# Altium schematic sheet Sheet1.SchDoc
size 420 x 297 mm; Address1: Address1; Address2: Address2; Address3: Address3; Address4: Address4; DocumentNumber: АБВГ.123456.001 Э3; SheetNumber: 1; Scale: 1:1; DocumentType: Схема электрическая принципиальная; FirstReferrence: АБВГ.123456.001
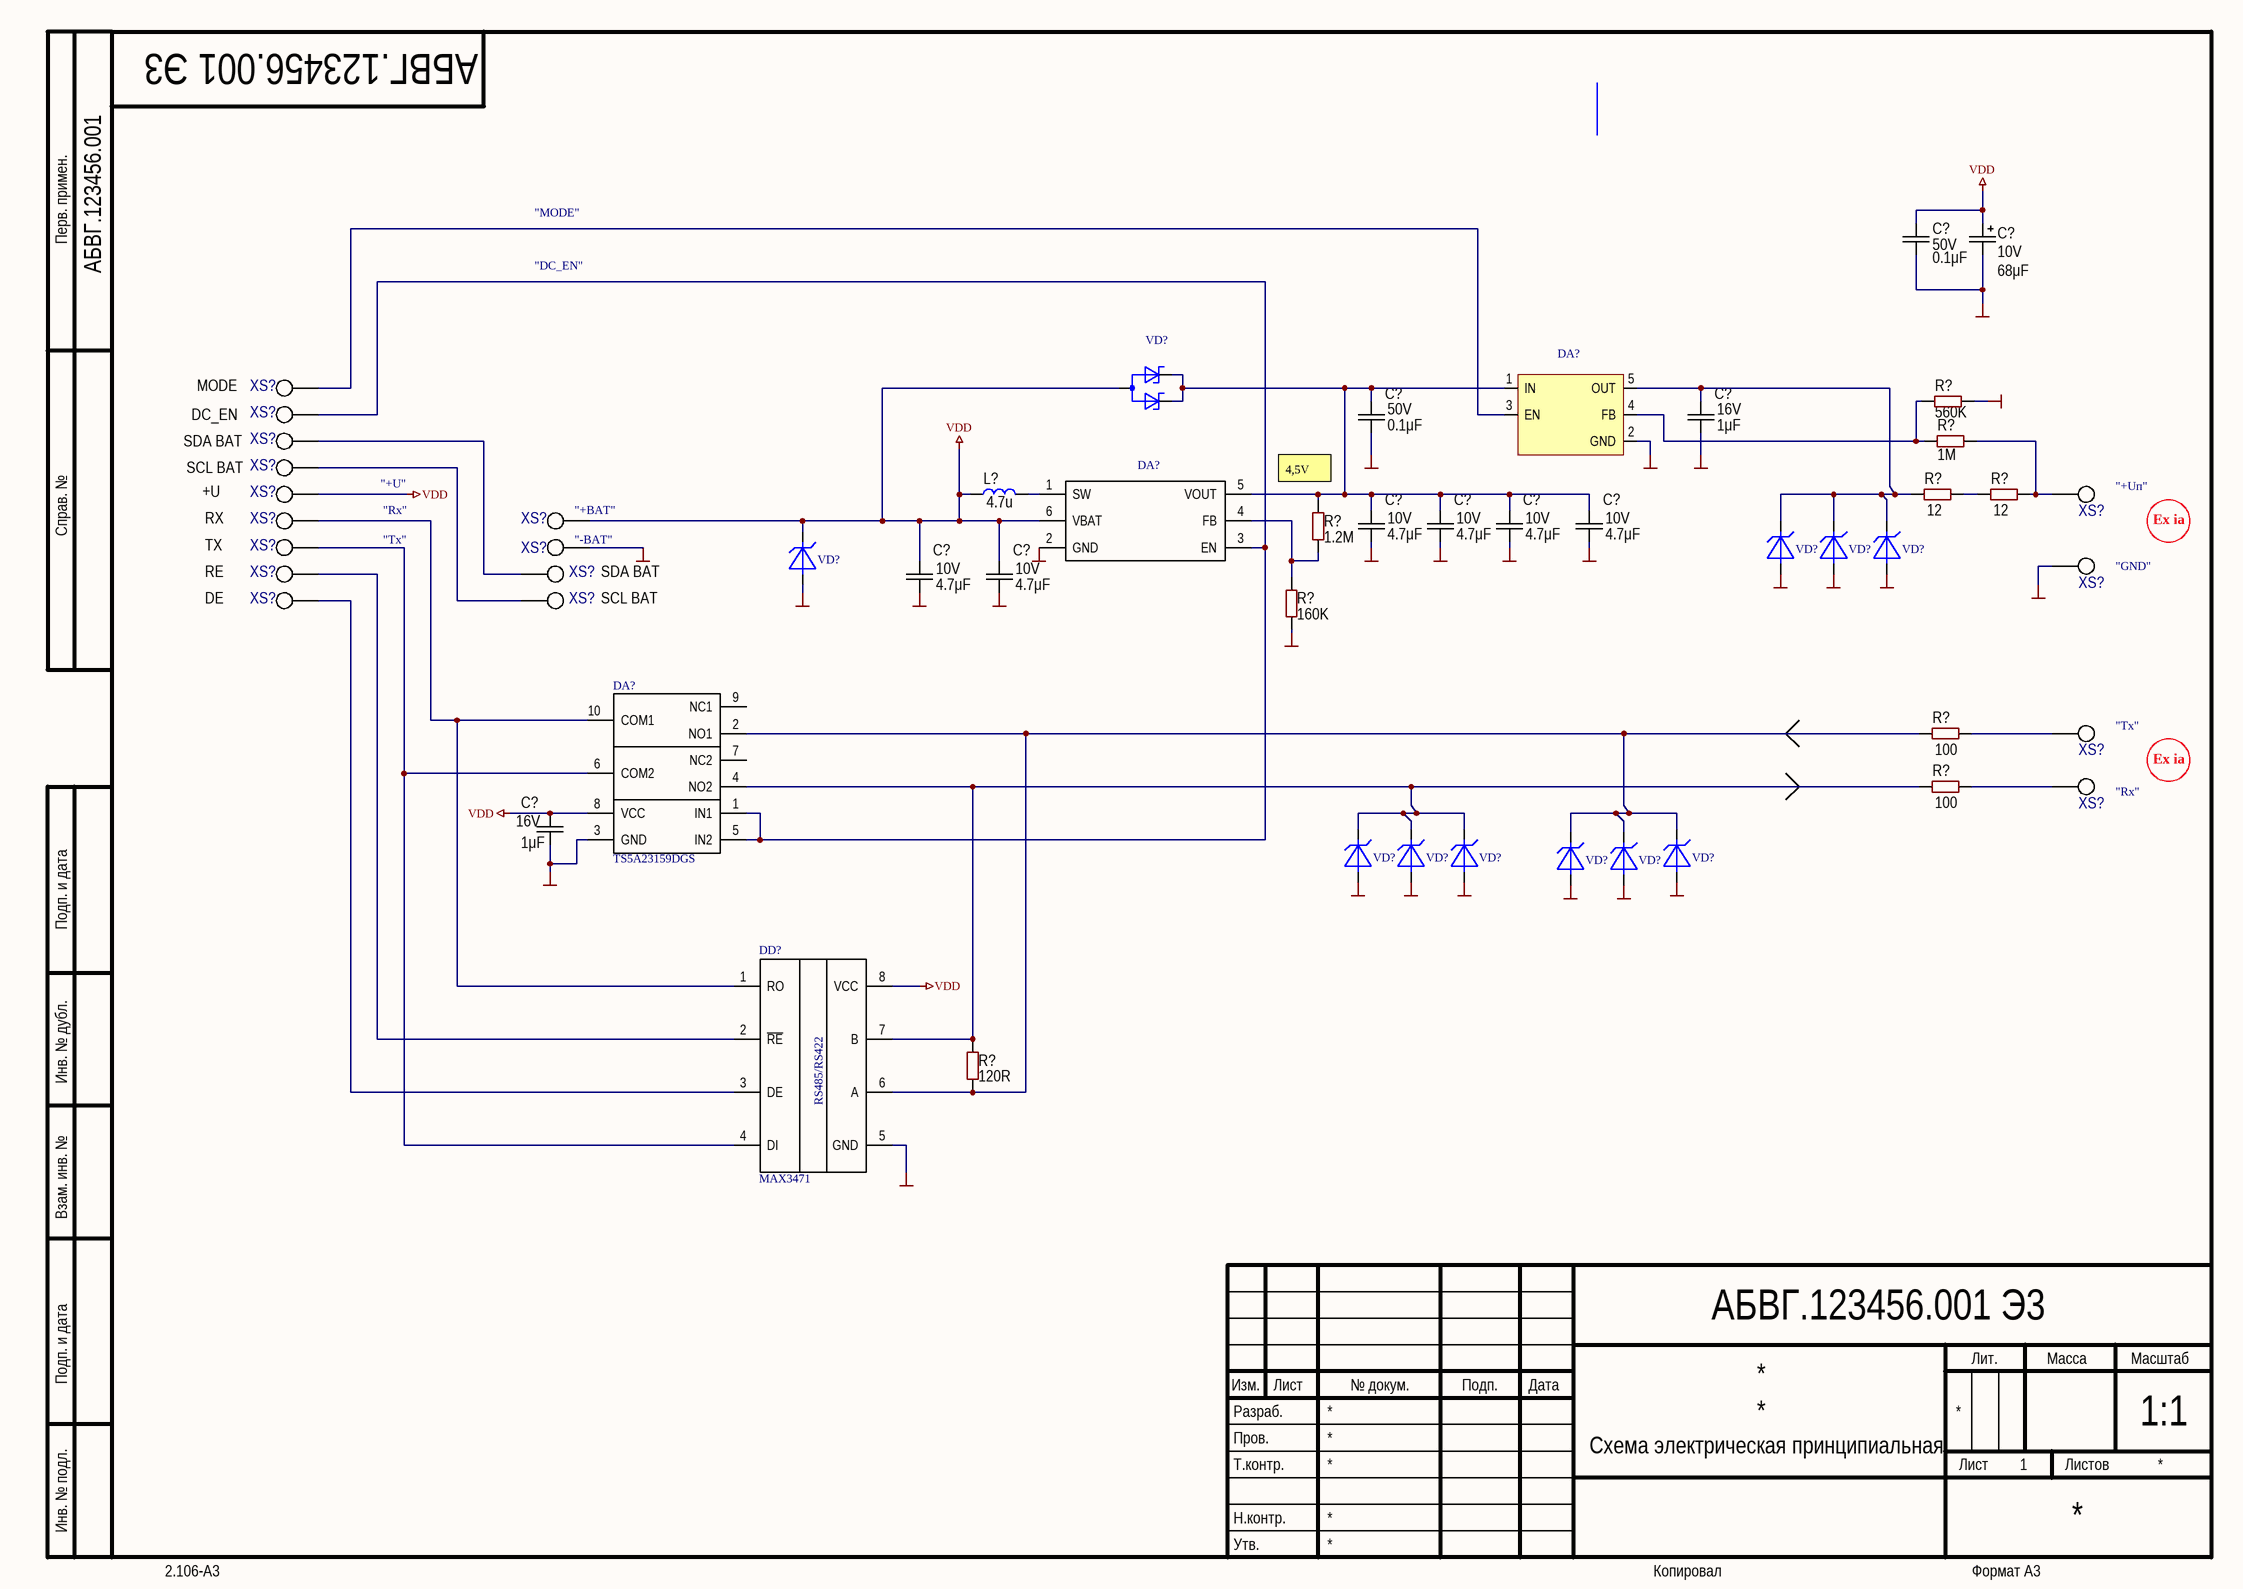
[diagram p0: Sheet1.SchDoc]

## Parts
(Parts that share a designator on the sheet are numbered #1, #2 ... from top to bottom, then left to right.)
C?#1  value 0.1μF  Voltage: 50V  [CAP: 0603]
C?#2  value 68μF  Voltage: 10V  [CAP: TANTAL-B]
C?#3  value 0.1μF  Voltage: 50V  [CAP: 0603]
C?#4  value 1μF  Voltage: 16V  [CAP: 0603]
C?#5  value 4.7μF  Voltage: 10V  [CAP: 0603]
C?#6  value 4.7μF  Voltage: 10V  [CAP: 0603]
C?#7  value 4.7μF  Voltage: 10V  [CAP: 0603]
C?#8  value 4.7μF  Voltage: 10V  [CAP: 0603]
C?#9  value 4.7μF  Voltage: 10V  [CAP: 0603]
C?#10  value 4.7μF  Voltage: 10V  [CAP: 0603]
C?#11  value 1μF  Voltage: 16V  [CAP: 0603]
DA?#1  TPS78001DDC  [SOT23-5]  (value not drawn)
DA?#2  TPS6107x  [SOT23-6]  (value not drawn)
DA?#3  TS5A23159DGS  [VSSSOP-10 - TI]
DD?  MAX3471  [MSOP-8]
L?  value 4.7u  [IND: CDRH4D28NP]  (hidden comment: CDRH4D)
R?#1  value 560K  [RES: 0603]
R?#2  value 1M  [RES: 0603]
R?#3  value 12  [RES: 2512]
R?#4  value 12  [RES: 2512]
R?#5  value 1.2M  [RES: 0603]
R?#6  value 160K  [RES: 0603]
R?#7  value 100  [RES: 2512]
R?#8  value 100  [RES: 2512]
R?#9  value 120R  [RES: 0603]
VD?#1  BAT54AW  [SC-70]  (value not drawn)
VD?#2  SM2T  [DO216-AA]  (value not drawn)
VD?#3  SM2T  [DO216-AA]  (value not drawn)
VD?#4  SM2T  [DO216-AA]  (value not drawn)
VD?#5  SM2T  [DO216-AA]  (value not drawn)
VD?#6  SM2T  [DO216-AA]  (value not drawn)
VD?#7  SM2T  [DO216-AA]  (value not drawn)
VD?#8  SM2T  [DO216-AA]  (value not drawn)
VD?#9  SM2T  [DO216-AA]  (value not drawn)
VD?#10  SM2T  [DO216-AA]  (value not drawn)
VD?#11  SM2T  [DO216-AA]  (value not drawn)
XS?#1  Testpoint_HS1mm  [TestPoint(1mm_HS)]  (value not drawn)
XS?#2  Testpoint_HS1mm  [TestPoint(1mm_HS)]  (value not drawn)
XS?#3  Testpoint_HS1mm  [TestPoint(1mm_HS)]  (value not drawn)
XS?#4  Testpoint_HS1mm  [TestPoint(1mm_HS)]  (value not drawn)
XS?#5  Testpoint_HS1mm  [TestPoint(1mm_HS)]  (value not drawn)
XS?#6  Testpoint_HS1mm  [TestPoint(1mm_HS)]  (value not drawn)
XS?#7  Testpoint_HS1mm  [TestPoint(1mm_HS)]  (value not drawn)
XS?#8  Testpoint_HS1mm  [TestPoint(1mm_HS)]  (value not drawn)
XS?#9  Testpoint_HS1mm  [TestPoint(1mm_HS)]  (value not drawn)
XS?#10  Testpoint_HS1mm  [TestPoint(1mm_HS)]  (value not drawn)
XS?#11  Testpoint_HS1mm  [TestPoint(1mm_HS)]  (value not drawn)
XS?#12  Testpoint_HS1mm  [TestPoint(1mm_HS)]  (value not drawn)
XS?#13  Testpoint_HS1mm  [TestPoint(1mm_HS)]  (value not drawn)
XS?#14  Testpoint_HS1mm  [TestPoint(1mm_HS)]  (value not drawn)
XS?#15  Testpoint_HS1mm  [TestPoint(1mm_HS)]  (value not drawn)
XS?#16  Testpoint_HS1mm  [TestPoint(1mm_HS)]  (value not drawn)
XS?#17  Testpoint_HS1mm  [TestPoint(1mm_HS)]  (value not drawn)

## Nets
GND: C?#1.1 C?#2.2 C?#3.1 C?#4.1 C?#5.1 C?#6.1 C?#7.1 C?#8.1 C?#9.1 C?#10.1 C?#11.1 DA?#1.2(GND) DA?#2.2(GND) DA?#3.3(GND) DD?.5(GND) R?#1.1 R?#6.1 VD?#2.2(A) VD?#3.2(A) VD?#4.2(A) VD?#5.2(A) VD?#6.2(A) VD?#7.2(A) VD?#8.2(A) VD?#9.2(A) VD?#10.2(A) VD?#11.2(A) XS?#10.1 XS?#11.1
VDD: C?#1.2 C?#2.1 C?#9.2 C?#10.2 C?#11.2 DA?#2.6(VBAT) DA?#3.8(VCC) DD?.8(VCC) L?.1 VD?#1.3(OA) VD?#5.1(C) XS?#5.1 XS?#8.1
NetC?#3_2: C?#3.2 C?#5.2 C?#6.2 C?#7.2 C?#8.2 DA?#1.1(IN) DA?#2.5(VOUT) R?#5.2 VD?#1.1(C) VD?#1.2(C)
NetC?#4_2: C?#4.2 DA?#1.5(OUT) R?#3.1 VD?#2.1(C) VD?#3.1(C) VD?#4.1(C)
NetDA?#1_3: DA?#1.3(EN) XS?#1.1
NetDA?#1_4: DA?#1.4(FB) R?#1.2 R?#2.2
NetDA?#2_1: DA?#2.1(SW) L?.2
NetDA?#2_3: DA?#2.3(EN) DA?#3.1(IN1) DA?#3.5(IN2) XS?#2.1
NetDA?#2_4: DA?#2.4(FB) R?#5.1 R?#6.2
NetDA?#3_2: DA?#3.2(NO1) DD?.6(A) R?#7.1 R?#9.1 VD?#9.1(C) VD?#10.1(C) VD?#11.1(C)
NetDA?#3_4: DA?#3.4(NO2) DD?.7(B) R?#8.1 R?#9.2 VD?#6.1(C) VD?#7.1(C) VD?#8.1(C)
NetDA?#3_6: DA?#3.6(COM2) DD?.4(DI) XS?#9.1
NetDA?#3_10: DA?#3.10(COM1) DD?.1(RO) XS?#7.1
NetDD?_2: DD?.2(~{RE}) XS?#12.1
NetDD?_3: DD?.3(DE) XS?#14.1
NetR?#2_1: R?#2.1 R?#4.2 XS?#6.1
NetR?#3_2: R?#3.2 R?#4.1
NetR?#7_2: R?#7.2 XS?#16.1
NetR?#8_2: R?#8.2 XS?#17.1
NetXS?#3_1: XS?#3.1 XS?#13.1
NetXS?#4_1: XS?#4.1 XS?#15.1

Not connected (* = marked no-connect by the designer): DA?#3 7(NC2) 9(NC1)

## Notes on the sheet
- "MODE"
- "DC_EN"
- MODE
- (near XS?#3) SDA BAT
- DC_EN
- (near XS?#4) SCL BAT
- +U
- RX
- "+U"
- "Rx"
- (near XS?#8) "+BAT"
- (near R?#5) 4,5V
- (near XS?#6) "+Uп"
- Ex ia
- TX
- RE
- "Tx"
- (near XS?#10) "-BAT"
- (near XS?#10) SDA BAT
- (near XS?#11) "GND"
- DE
- (near XS?#15) SCL BAT
- (near XS?#16) "Tx"
- (near XS?#17) "Rx"
- Перв. примен.
- Справ. №
- Подп. и дата
- Инв. № дубл.
- Взам. инв. №
- Разраб.
- Изм.
- Лист
- № докум.
- Подп.
- Дата
- Лит.
- Масса
- Масштаб
- Пров.
- Т.контр.
- Листов
- Инв. № подл.
- Утв.
- Н.контр.
- 2.106-A3
- Копировал
- Формат А3
- (in symbol MAX3471) RS485/RS422

## Library data of the parts
C?#1 C?#3 = Ceramic_0603: Manufacturer: Yageo; PartNumber: CC0603KRX7R7BB104; ValueManufacturerPartNumber: Ceramic capacitor, 0.1μF, X7R, ±10%, 50V, 0603, -55...+125°C; TypeCapacitor: Ceramic capacitor; Tolerance: ±10%; TypeDielectric: X7R; Package: 0603; HelpURL: https://www.digikey.com/product-detail/en/yageo/CC0603KRX7R7BB104/311-1088-1-ND/302998; Temperature: -55...+125°C
C?#2 = Tantal_B: Manufacturer: AVX; PartNumber: F930J227KBA; ValueManufacturerPartNumber: Tantalum capacitor, 68μF, 10V, ±10%, 1.2Ohm, case B (3528), -55...+125°C; Impedance: 1.2Ohm; Tolerance: ±10%; TypeDielectric: X7R; TypeCapacitor: Tantalum capacitor; Package: case B (3528); HelpURL: https://www.digikey.com/product-detail/en/avx-corporation/F930J227KBA/478-8166-1-ND/4005570; Temperature: -55...+125°C
C?#4 C?#11 = Ceramic_0603: Manufacturer: Yageo; PartNumber: CC0603KRX7R7BB104; ValueManufacturerPartNumber: Ceramic capacitor, 1μF, X7R, ±10%, 16V, 0603, -55...+125°C; TypeCapacitor: Ceramic capacitor; Tolerance: ±10%; TypeDielectric: X7R; Package: 0603; HelpURL: https://www.digikey.com/product-detail/en/yageo/CC0603KRX7R7BB104/311-1088-1-ND/302998; Temperature: -55...+125°C
C?#5-C?#10 = Ceramic_0603: Manufacturer: Yageo; PartNumber: CC0603KRX7R7BB104; ValueManufacturerPartNumber: Ceramic capacitor, 4.7μF, X7R, ±10%, 10V, 0603, -55...+125°C; TypeCapacitor: Ceramic capacitor; Tolerance: ±10%; TypeDielectric: X7R; Package: 0603; HelpURL: https://www.digikey.com/product-detail/en/yageo/CC0603KRX7R7BB104/311-1088-1-ND/302998; Temperature: -55...+125°C
DA?#1 = TPS78001DDC: Микросхема; Manufacturer: Texas Instruments; Part Number: TPS780270200DDCT; ComponentLink1Description: Data Sheet; ComponentLink1URL: http://focus.ti.com/lit/ds/symlink/tps780270200.pdf
DA?#2 = TPS61070: Микросхема; Manufacturer: Texas Instruments; ComponentLink1Description: Data Sheet; ComponentLink3URL: *; ReplacementPart1Manufacturer: *; ReplacementPart1PartNumber: *; ReplacementPart1TopMarking: *; ReplacementPart2Manufacturer: *; ReplacementPart2PartNumber: *; ReplacementPart2TopMarking: *; TopMarking: *; PartNumber: TPS6107x
DA?#3 = TS5A23159DGS: Микросхема; Manufacturer: Texas Instruments; PartNumber: TS5A23159DGS
DD? = MAX3471: RS-485/RS422Half-Duplex,  Differential Transceiver for Battery-Powered Systems; Manufacturer: MAXIM; ComponentLink1Description: Data Sheet; ComponentLink1URL: \\Mskd20virt\KB\PDF\Интерфейсы\RS232_485\MAX3471.pdf; ComponentLink2Description: Replacement 1 Data Sheet; PartNumber: MAX3471
L? = CDRH4D28NP: ComponentLink1Description: Datasheet; ComponentLink1URL: https://products.sumida.com/products/pdf/CDRH4D28.pdf
R?#1 = Resistor_0603: Manufacturer: Yageo; PartNumber: RC0603JR-07100RL; ValueManufacturerPartNumber: Resistor film, 560K, ±5%, 0603, 0.1W, -55...+125°C; TypeResistor: Resistor film; Power: 0.1W; Tolerance: ±5%; Package: 0603; HelpURL: https://www.digikey.com/product-detail/en/yageo/RC0603JR-07100RL/311-100GRCT-ND/729644; Temperature: -55...+125°C
R?#2 = Resistor_0603: Manufacturer: Yageo; PartNumber: RC0603JR-07100RL; ValueManufacturerPartNumber: Resistor film, 1M, ±5%, 0603, 0.1W, -55...+125°C; TypeResistor: Resistor film; Power: 0.1W; Tolerance: ±5%; Package: 0603; HelpURL: https://www.digikey.com/product-detail/en/yageo/RC0603JR-07100RL/311-100GRCT-ND/729644; Temperature: -55...+125°C
R?#3 R?#4 = Resistor_2512: Manufacturer: Yageo; PartNumber: RC2512JK-07100RL; ValueManufacturerPartNumber: Resistor film, 12, ±5%, 2512, 1W, -55...+125°C; TypeResistor: Resistor film; Power: 1W; Tolerance: ±5%; Package: 2512; HelpURL: https://www.digikey.com/product-detail/en/yageo/RC2512JK-07100RL/YAG3393CT-ND/5962215; Temperature: -55...+125°C
R?#5 = Resistor_0603: Manufacturer: Yageo; PartNumber: RC0603JR-07100RL; ValueManufacturerPartNumber: Resistor film, 1.2M, ±5%, 0603, 0.1W, -55...+125°C; TypeResistor: Resistor film; Power: 0.1W; Tolerance: ±5%; Package: 0603; HelpURL: https://www.digikey.com/product-detail/en/yageo/RC0603JR-07100RL/311-100GRCT-ND/729644; Temperature: -55...+125°C
R?#6 = Resistor_0603: Manufacturer: Yageo; PartNumber: RC0603JR-07100RL; ValueManufacturerPartNumber: Resistor film, 160K, ±5%, 0603, 0.1W, -55...+125°C; TypeResistor: Resistor film; Power: 0.1W; Tolerance: ±5%; Package: 0603; HelpURL: https://www.digikey.com/product-detail/en/yageo/RC0603JR-07100RL/311-100GRCT-ND/729644; Temperature: -55...+125°C
R?#7 R?#8 = Resistor_2512: Manufacturer: Yageo; PartNumber: RC2512JK-07100RL; ValueManufacturerPartNumber: Resistor film, 100, ±5%, 2512, 1W, -55...+125°C; TypeResistor: Resistor film; Power: 1W; Tolerance: ±5%; Package: 2512; HelpURL: https://www.digikey.com/product-detail/en/yageo/RC2512JK-07100RL/YAG3393CT-ND/5962215; Temperature: -55...+125°C
R?#9 = Resistor_0603: Manufacturer: Yageo; PartNumber: RC0603JR-07100RL; ValueManufacturerPartNumber: Resistor film, 120R, ±5%, 0603, 0.1W, -55...+125°C; TypeResistor: Resistor film; Power: 0.1W; Tolerance: ±5%; Package: 0603; HelpURL: https://www.digikey.com/product-detail/en/yageo/RC0603JR-07100RL/311-100GRCT-ND/729644; Temperature: -55...+125°C
VD?#1 = BAT54AW: Сборка диодная; Manufacturer: NXP; ReplacementPart2TopMarking: TA; ReplacementPart1Manufacturer: ON Semiconductor; ReplacementPart1PartNumber: BAT54AWT1G; ReplacementPart1TopMarking: B7*; ReplacementPart2Manufacturer: Infineon; ReplacementPart2PartNumber: BAT54-06W; TopMarking: 42; Type: *; Power/Voltage: *; PartNumber: BAT54AW; Package: SC-70; ComponentLink1Description: DataSheet; ComponentLink1URL: http://www.nxp.com/documents/data_sheet/BAT54W.pdf; ComponentLink2URL: http://www.onsemi.com/pub_link/Collateral/BAT54AWT1-D.PDF; ComponentLink3Description: Replacement2DataSheet; ComponentLink3URL: http://www.infineon.com/dgdl/bat54series.pdf?folderId=db3a30431400ef68011425f1ca2505e3&fileId=db3a304314dca3890115190b74210ea6; ComponentLink2Description: Replacement1DataSheet
VD?#2-VD?#11 = SM2T: TVS Диод; Manufacturer: ST Microelectronics; ComponentLink1Descriprion: Data Sheet; ComponentLink1URL: *; ComponentLink2Description: Replacement 1 Data Sheet; ComponentLink2URL: *; ComponentLink3Description: Replacement 2 Data Sheet; ComponentLink3URL: *; PartNumber: *; ReplacementPart1Manufacturer: *; ReplacementPart1PartNumber: *; ReplacementPart1TopMarking: *; ReplacementPart2Manufacturer: *; ReplacementPart2TopMarking: *; TopMarking: *; ReplacementPart2PartNumber: *; StandOffVoltage: *